# EAGLE design magloop_ad8129 (EAGLE 9.6.2)
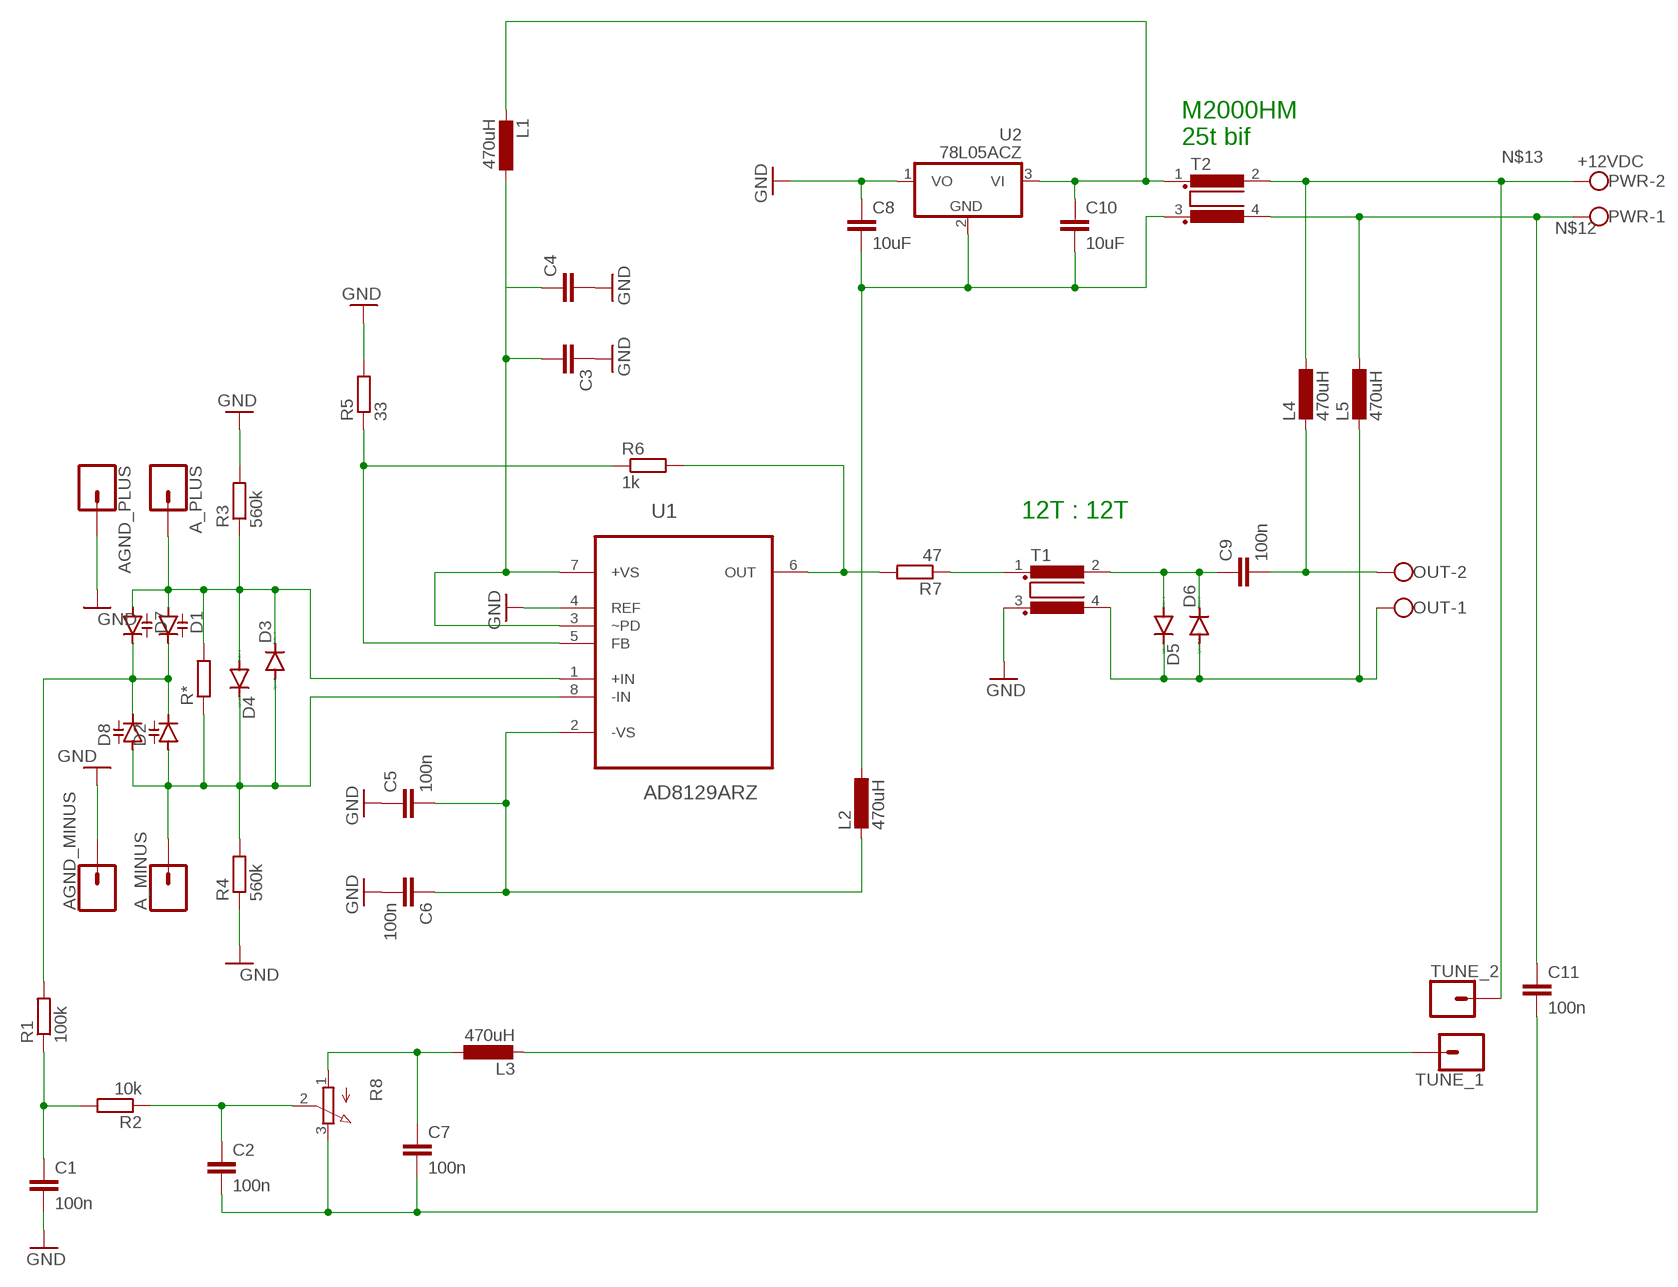
[diagram p0: schematic, sheet 1]

## Parts
A_MINUS  CONN_01PTH_2MM  [1X01_2MM]
A_PLUS  CONN_01PTH_2MM  [1X01_2MM]
AGND_MINUS  CONN_01PTH_2MM  [1X01_2MM]
AGND_PLUS  CONN_01PTH_2MM  [1X01_2MM]
C1  100n  C-EUC1206  [C1206]
C2  100n  C-EUC1206  [C1206]
C3  C-EUC1206K  [C1206K]
C4  C-EUC1206K  [C1206K]
C5  100n  C-EUC1206K  [C1206K]
C6  100n  C-EUC1206K  [C1206K]
C7  100n  C-EUC1206  [C1206]
C8  10uF  C-EUC1206K  [C1206K]
C9  100n  C-EUC1206  [C1206]
C10  10uF  C-EUC1206K  [C1206K]
C11  100n  C-EUC1206K  [C1206K]
D1  1SV149  DIODE_CAPACITANCE-SOT54H  [SOT54H]
D2  1SV149  DIODE_CAPACITANCE-SOT54H  [SOT54H]
D3  LL4148  CGRM4001-G  [SOD-123_MINI-SMA]
D4  LL4148  CGRM4001-G  [SOD-123_MINI-SMA]
D5  CGRM4001-G  [SOD-123_MINI-SMA]
D6  CGRM4001-G  [SOD-123_MINI-SMA]
D7  1SV149  DIODE_CAPACITANCE-SOT54H  [SOT54H]
D8  1SV149  DIODE_CAPACITANCE-SOT54H  [SOT54H]
L1  470uH  L-EU0207/10  [0207/10]
L2  470uH  L-EU0207/10  [0207/10]
L3  470uH  L-EU0207/10  [0207/10]
L4  470uH  L-EU0207/10  [0207/10]
L5  470uH  L-EU0207/10  [0207/10]
OUT  W237-102  [W237-102]
PWR  +12VDC  W237-102  [W237-102]
R1  100k  R-EU_R1206  [R1206]
R2  10k  R-EU_R1206  [R1206]
R3  560k  R-EU_R1206  [R1206]
R4  560k  R-EU_R1206  [R1206]
R5  33  R-EU_R1206  [R1206]
R6  1k  R-EU_R1206  [R1206]
R7  47  R-EU_R1206  [R1206]
R8  3RP/1610N  [3RP/1610N]
R*  R-EU_R1206  [R1206]
T1  R1405UB1/2  [B1/2]
T2  R1405UB1/2  [B1/2]
TUNE_1  CONN_01OFFSET  [1X01_OFFSET]
TUNE_2  CONN_01OFFSET  [1X01_OFFSET]
U1  AD8129ARZ  [SOIC127P600X175-8N]
U2  78L05ACZ  [TO-92]

## Nets
GND: AGND_MINUS.1 AGND_PLUS.1 C1.2 C3.1 C4.2 C5.1 C6.2 C8.1 R3.2 R4.1 R5.2 T1.3 U1.4(REF) U2.1(VO)
MINUS: C2.2 C7.2 C11.2 R8.3(E)
N$1: A_PLUS.1 D1.A D3.C D4.A D7.A R3.1 R*.2 U1.1(+IN)
N$2: D1.C D2.C D7.C D8.C R1.2
N$3: A_MINUS.1 D2.A D3.A D4.C D8.A R4.2 R*.1 U1.8(-IN)
N$4: R5.1 R6.1 U1.5(FB)
N$5: R6.2 R7.2 U1.6(OUT)
N$6: C1.1 R1.1 R2.2
N$7: C2.1 R2.1 R8.2(S)
N$8: C7.1 L3.1 R8.1(A)
N$9: C3.2 C4.1 L1.1 U1.3(~PD) U1.7(+VS)
N$10: C10.1 L1.2 T2.1 U2.3(VI)
N$11: C8.2 C10.2 L2.1 T2.3 U2.2(GND)
N$12: C11.1 L5.1 PWR.1 T2.4
N$13: L4.1 PWR.2 T2.2 TUNE_2.1
N$14: C5.2 C6.1 L2.2 U1.2(-VS)
N$15: R7.1 T1.1
N$16: C9.1 D5.A D6.C T1.2
N$17: C9.2 L4.2 OUT.2
N$18: D5.C D6.A L5.2 OUT.1 T1.4
PLUS: L3.2 TUNE_1.1

## Notes on the sheet
- M2000HM
  25t bif
- 12T : 12T

## Library data of the parts
A_MINUS A_PLUS TUNE_1 TUNE_2 = Connectors:CONN_01: Single connection point. Often used as Generic Header-pin footprint for 0.1 inch spaced/style header connections On any of the 0.1 inch spaced packages, you can populate with these: Break Away Headers - Straight <https://www.sparkfun.com/products/116> (PRT-00116) Break Away Male Headers - Right Angle <https://www.sparkfun.com/products/553> (PRT-00553) Female Headers <https://www.sparkfun.com/products/115> (PRT-00115) Break Away Headers - Machine Pin <https://www.sparkfun.com/products/117> (PRT-00117) Break Away Female Headers - Swiss Machine Pin <https://www.sparkfun.com/products/743> (PRT-00743) This device is also useful as a general connection point to wire up your design to another part of your project. Our various solder wires solder well into these plated through hole pads. Hook-Up Wire - Assortment (Stranded, 22 AWG) <https://www.sparkfun.com/products/11375> (PRT-11375) Hook-Up Wire - Assortment (Solid Core, 22 AWG) <https://www.sparkfun.com/products/11367> (PRT-11367) View the entire wire category on our website here <https://www.sparkfun.com/categories/141> Special notes: SMTSO-256-ET is a "flush mount" nut for a 4-40 screw. We mostly use this on specialty testbeds; it is a nice way to connect hardware to your PCB at an adjustable hieght. Also note, the SNAP packages are for using a snappable style connector. We sell a baggie of snaps and they are also used on two LilyPad designs: Snap Assortment - 30 pack (male and female) <https://www.sparkfun.com/products/11347> (DEV-11347) LilyPad Arduino SimpleSnap <https://www.sparkfun.com/products/10941> (DEV-10941) LilyPad SimpleSnap Protoboard <https://www.sparkfun.com/products/10940> (DEV-10940)
AGND_MINUS AGND_PLUS = SparkFun-Connectors:CONN_01: Single connection point. Often used as Generic Header-pin footprint for 0.1 inch spaced/style header connections On any of the 0.1 inch spaced packages, you can populate with these: Break Away Headers - Straight <https://www.sparkfun.com/products/116> (PRT-00116) Break Away Male Headers - Right Angle <https://www.sparkfun.com/products/553> (PRT-00553) Female Headers <https://www.sparkfun.com/products/115> (PRT-00115) Break Away Headers - Machine Pin <https://www.sparkfun.com/products/117> (PRT-00117) Break Away Female Headers - Swiss Machine Pin <https://www.sparkfun.com/products/743> (PRT-00743) This device is also useful as a general connection point to wire up your design to another part of your project. Our various solder wires solder well into these plated through hole pads. Hook-Up Wire - Assortment (Stranded, 22 AWG) <https://www.sparkfun.com/products/11375> (PRT-11375) Hook-Up Wire - Assortment (Solid Core, 22 AWG) <https://www.sparkfun.com/products/11367> (PRT-11367) View the entire wire category on our website here <https://www.sparkfun.com/categories/141> Special notes: SMTSO-256-ET is a "flush mount" nut for a 4-40 screw. We mostly use this on specialty testbeds; it is a nice way to connect hardware to your PCB at an adjustable hieght. Also note, the SNAP packages are for using a snappable style connector. We sell a baggie of snaps and they are also used on two LilyPad designs: Snap Assortment - 30 pack (male and female) <https://www.sparkfun.com/products/11347> (DEV-11347) LilyPad Arduino SimpleSnap <https://www.sparkfun.com/products/10941> (DEV-10941) LilyPad SimpleSnap Protoboard <https://www.sparkfun.com/products/10940> (DEV-10940)
C1-C11 = rcl_home_optimized:C-EU: CAPACITOR, European symbol; SPICEPREFIX: C
D1 D2 D7 D8 = diode:DIODE_CAPACITANCE-: Capacity DIODE
D3-D6 = diode:CGRM400*-G: Molded plasitc,JEDEC SOD-123/Mini SMA Source: Comchip CGRM4001-G.pdf
L1-L5 = rcl_home_optimized:L-EU: INDUCTOR, European symbol; SPICEPREFIX: L
OUT PWR = con-wago-500:W237-102: WAGO SCREW CLAMP; MPN: 237-102; OC_FARNELL: unknown; OC_NEWARK: 70K9898
R1-R7 R* = rcl_home_optimized:R-EU_: RESISTOR, European symbol; SPICEPREFIX: R
R8 = pot:3RP/1610N: 16mm Potentiometer one level Source: http://www.alphapotentiometers.net/html/16mm_pot_2.html
T1 T2 = inductor-nkl:R1405U: Gleichtakt-Entstördrossel (über typ. 5MHz) common mode choke (above typ.5MHz); OC_FARNELL: unknown; OC_NEWARK: unknown
U1 = AD8129ARZ:AD8129ARZ: Low Cost 270 MHz Differential Receiver Amplifiers Check prices <https://pricing.snapeda.com/parts/AD8129ARZ/Analog%20Devices/view-part?ref=eda>; AVAILABILITY: In Stock; DESCRIPTION: Differential Amplifier 1 Circuit - 8-SOIC; MF: Analog Devices; MP: AD8129ARZ; PACKAGE: SOIC-8 Analog Devices; PRICE: None; PURCHASE-URL: https://pricing.snapeda.com/search/part/AD8129ARZ/?ref=eda
U2 = 78L05ACZ:78L05ACZ: Check prices <https://pricing.snapeda.com/parts/78L05ACZ/STMicroelectronics/view-part?ref=eda>; AVAILABILITY: In Stock; DESCRIPTION: Linear Voltage Regulator IC Positive Fixed 1 Output 100mA TO-92-3; MF: STMicroelectronics; MP: 78L05ACZ; PACKAGE: TO-92 STMicroelectronics; PRICE: None; PURCHASE-URL: https://pricing.snapeda.com/search/part/78L05ACZ/?ref=eda

## Board
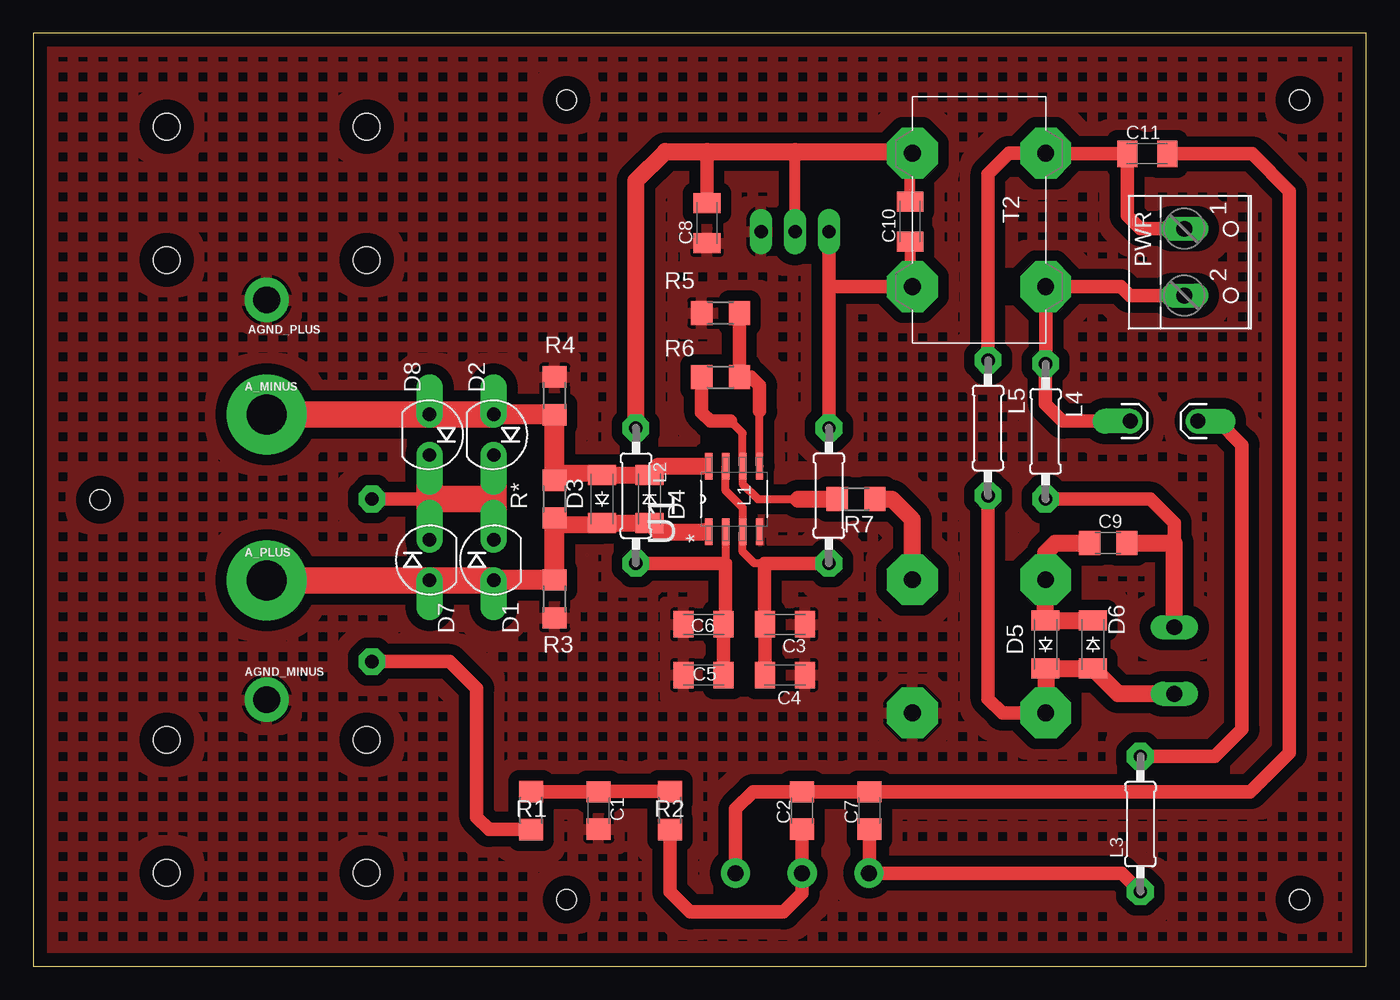
[diagram p1: board, top side]
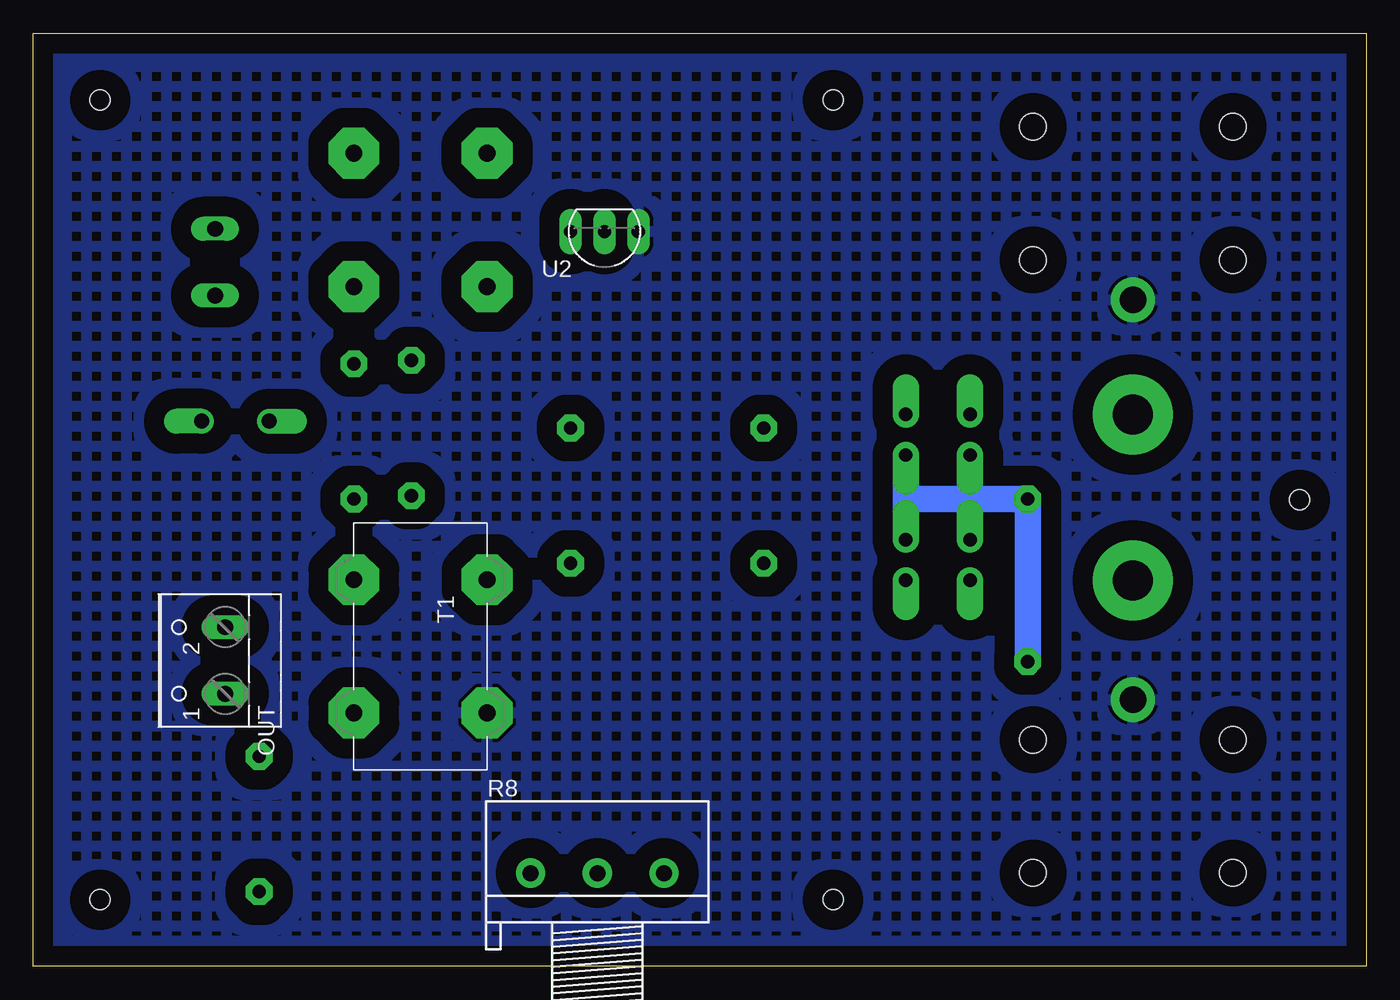
[diagram p2: board, bottom side, seen from below]

Size 100 x 70 mm. Coordinates in mm from the lower left corner, seen from the top.
Outline: 0,0 100,0 100,70 0,70 0,0
Copper layers (1*16): Top 0.035mm / dielectric 1.5mm / Bottom 0.035mm
Design rules "default": minimum track width 6mil, minimum drill 0.35mm, track to track 6mil, track to pad 6mil, pad to pad 6mil, via to via 6mil, smd to smd 6mil, copper to edge 40mil, drill to drill 6mil, minimum pad ring 10mil, minimum via ring 8mil, stop-mask expansion 4mil, vias tented up to drill 0mil, thermal gap 10mil
Holes 2 mm at 10,7 10,63 25,7 25,63 10,17 25,17 25,53 10,53
Holes 1.5 mm at 95,5 95,65 40,65 40,5 5,35

### Footprints (pad centres in the part's own frame; a part is rotated, then mirrored left to right if it is on the bottom)
1X01_2MM = drill 3 pad 6: 1 0,0
1X01_2MM' = drill 2 pad 3.302: 1 0,0
C1206 = smd 1.6 x 1.8: 1 -1.4,0; 2 1.4,0
C1206K = smd 1.5 x 2: 1 -1.5,0; 2 1.5,0
SOT54H = drill 1 pad 2 offset: A 1.524,0; C -1.524,0
SOD-123_MINI-SMA = smd 1.5 x 2.1: A 1.8,0; C -1.8,0
0207/10 = drill 1 pad 2 octagon: 1 -5.08,0; 2 5.08,0
W237-102 = drill 1.194 long: 1 -2.5,-1.27; 2 2.5,-1.27
R1206 = smd 1.6 x 1.803: 1 -1.422,0; 2 1.422,0
3RP/1610N = drill 1.2 pad 2.184: 1 -5,0; 2 0,0; 3 5,0
B1/2 = drill 1.27 pad 3.81 octagon: 1 -5,5; 2 -5,-5; 3 5,5; 4 5,-5
1X01_OFFSET = drill 1.118 pad 1.88 offset: 1 0,0
SOIC127P600X175-8N = smd 1.981 x 0.559: 1 -2.464,1.905; 2 -2.464,0.635; 3 -2.464,-0.635; 4 -2.464,-1.905; 5 2.464,-1.905; 6 2.464,-0.635; 7 2.464,0.635; 8 2.464,1.905
TO-92 = drill 1 pad 1.7 long: 1 -2.54,0; 2 0,0; 3 2.54,0

### Placement (x,y rotation side)
A_MINUS  17.5,41.4 0 top
A_PLUS  17.5,28.96 0 top
AGND_MINUS  [1X01_2MM']  17.5,20 0 top
AGND_PLUS  [1X01_2MM']  17.5,50 0 top
C1  42.42,11.68 270 top
C2  57.66,11.68 90 top
C3  56.39,25.65 180 top
C4  56.39,21.84 0 top
C5  50.29,21.84 0 top
C6  50.29,25.65 180 top
C7  62.74,11.68 90 top
C8  50.55,55.75 90 top
C9  80.64,31.75 0 top
C10  65.79,55.88 90 top
C11  83.57,60.96 0 top
D1  34.54,30.48 270 top
D2  34.54,39.88 90 top
D3  42.67,35.05 90 top
D4  46.23,35.05 270 top
D5  75.95,24.13 90 top
D6  79.5,24.13 270 top
D7  29.72,30.48 270 top
D8  29.72,39.88 90 top
L1  59.69,35.31 90 top
L2  45.21,35.31 270 top
L3  83.06,10.67 90 top
L4  75.95,40.13 270 top
L5  71.63,40.39 270 top
OUT  86.87,22.94 90 bottom
PWR  87.64,52.83 270 top
R1  37.34,11.68 270 top
R2  47.75,11.68 90 top
R3  39.12,27.56 270 top
R4  39.12,42.8 270 top
R5  51.56,49.02 180 top
R6  51.56,44.2 180 top
R7  61.72,35.05 180 top
R8  57.69,6.98 0 bottom
R*  39.12,35.05 270 top
T1  70.95,24 270 bottom
T2  70.95,56 90 top
TUNE_1  87.38,40.89 270 top
TUNE_2  82.3,40.89 90 top
U1  52.58,35.05 90 top
U2  57.15,55.12 180 bottom

### Tracks (layer width: path | path; a pad name or v marks a point on that pad's centre or on a via)
GND
  pour Top (isolate 0.813, hatched): -1.52,72.14 -1.52,-2.29 102.62,-2.29 102.62,72.14
  pour Bottom (isolate 1.5, hatched): 101.85,-3.05 -1.78,-3.05 -1.78,72.39 101.85,72.39
MINUS
  Top 1.016: R8.3 52.69,11.79 53.98,13.08 C2.2 C7.2 91.32,13.08 94.23,16 94.23,58.17 91.44,60.96 C11.2
N$1
  Top 0.61: 50.29,32.59 U1.1
  Top 0.813: D3.C 42.54,33.12 | R*.2 39.62,33.12
  Top 1.016: 34.57,28.98 D1.A
  Top 1.27: D3.C D4.A 46.89,32.59 50.29,32.59 | 42.54,33.12 39.62,33.12
  Top 1.5: R*.2 R3.1 34.57,28.98
  Top 2: D1.A D7.A A_PLUS.1
N$2  (via drill 1 pad 2)
  Top 1.016: v25.4,35.05 29.72,35.05 | R1.2 34.19,10.26 33.27,11.18 33.27,20.83 31.24,22.86 v25.4,22.86
  Top 2: D1.C 34.54,35.05 | 34.54,35.05 D2.C | D8.C 29.72,35.05 | 29.72,35.05 D7.C | 29.72,35.05 34.54,35.05
  Bottom 2: v25.4,22.86 v25.4,35.05 29.72,35.05 | 29.72,35.05 D7.C | D2.C 34.54,35.05 | 34.54,35.05 D1.C | D8.C 29.72,35.05 | 29.72,35.05 34.54,35.05
N$3
  Top 0.61: U1.8 50.16,37.52
  Top 0.813: R*.1 39.62,36.98 | D3.A 42.54,36.98
  Top 1.016: 34.57,41.38 D2.A
  Top 1.27: D3.A D4.C 46.89,37.52 50.16,37.52 | 42.54,36.98 39.62,36.98
  Top 1.5: R*.1 R4.2 34.57,41.38
  Top 2: D2.A D8.A A_MINUS.1
N$4
  Top 0.61: U1.5 54.48,41.66
  Top 1.016: 54.48,41.66 54.48,43.56 53.85,44.2 R6.1 R5.1
N$5
  Top 0.61: 57.4,35.05 54.36,35.05 53.21,36.2 U1.6 53.21,40.01 52.32,40.89
  Top 1.016: 52.32,40.89 50.8,40.89 50.14,41.55 R6.2
  Top 1.27: 57.4,35.05 R7.2
N$6
  Top 1.016: R2.2 42.44,13.11 C1.1 37.36,13.08 R1.1
N$7
  Top 1.016: C2.1 57.66,7.01 R8.2 57.69,5.46 56.29,4.06 49.28,4.06 47.75,5.59 R2.1
N$8
  Top 1.016: C7.1 62.74,7.04 R8.1 81.66,6.98 L3.1
N$9
  Top 0.61: U1.7 51.94,35.69 53.21,34.42 U1.3 53.21,31.11 54.1,30.23 56.64,30.23
  Top 1.016: L1.1 56.64,30.23 54.86,30.23 54.86,25.68 C3.2 C4.1
N$10
  Top 0.813: C10.1 65.79,51.18 T2.1
  Top 1.016: L1.2 59.69,51.05 | 59.69,51.05 U2.3 | T2.1 59.74,51 59.69,51.05
N$11
  Top 0.813: C10.2 65.79,61.11 | U2.2 57.15,61.13
  Top 1.016: C8.2 50.55,61.13
  Top 1.27: 65.79,61.11 T2.3 65.74,61.13 57.15,61.13 50.55,61.13 47.42,61.13 45.21,58.93 L2.1
N$12
  Top 1.016: L5.1 71.63,59.44 73.19,61 T2.4 75.98,60.96 C11.1 82.07,56.32 83.06,55.33 PWR.1
N$13
  Top 1.016: PWR.2 82.26,50.33 81.59,51 T2.2 L4.1 75.95,42.16 77.22,40.89 TUNE_2.1
N$14
  Top 0.61: U1.2 51.94,30.23
  Top 1.016: L2.2 51.94,30.23 51.94,25.8 C6.1 C5.2
N$15
  Top 1.27: T1.1 65.95,33.51 64.41,35.05 R7.1
N$16
  Top 1.016: T1.2
  Top 1.27: T1.2 D5.A D6.C | T1.2 75.95,31.03 76.67,31.75 C9.1
N$17
  Top 1.016: 85.6,31.75 85.6,33.27 83.82,35.05 L4.2
  Top 1.27: OUT.2 85.6,31.75 C9.2
N$18
  Top 1.016: T1.4 72.69,19 71.63,20.07 L5.2 | D5.C
  Top 1.27: D5.C T1.4 | D5.C D6.A 81.4,20.44 OUT.1
PLUS
  Top 1.016: TUNE_1.1 88.9,40.89 90.68,39.12 90.68,17.78 88.65,15.75 L3.2